# Altium project SHIELD5.PrjPCB
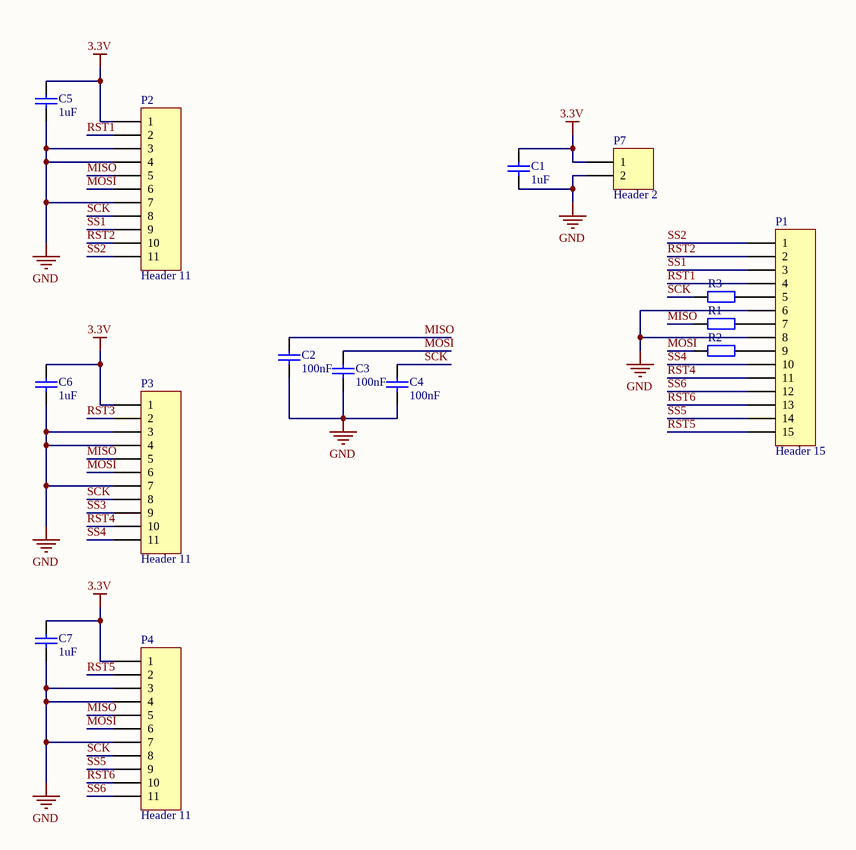
[diagram p0: SHIELD5.SchDoc]
1 sheet, 15 parts. Net scope: global (net labels, ports and power ports of the same name join across sheets).
Board file: PCB5.PcbDoc

## Sheet SHIELD5.SchDoc
size A4

### Parts
C1  value 1uF  [C0805]  (hidden comment: Cap)
C2  value 100nF  [C0805]  (hidden comment: Cap)
C3  value 100nF  [C0805]  (hidden comment: Cap)
C4  value 100nF  [C0805]  (hidden comment: Cap)
C5  value 1uF  [C0805]  (hidden comment: Cap)
C6  value 1uF  [C0805]  (hidden comment: Cap)
C7  value 1uF  [C0805]  (hidden comment: Cap)
P1  Header 15  [HDR1X15]
P2  Header 11  [HDR1X11]
P3  Header 11  [HDR1X11]
P4  Header 11  [HDR1X11]
P7  Header 2  [HDR1X2]
R1  Res2  [6-0805_N]  (value not drawn)
R2  Res2  [6-0805_N]  (value not drawn)
R3  Res2  [6-0805_N]  (value not drawn)

### Nets
3.3V: C1.2 C5.2 C6.2 C7.2 P2.1 P3.1 P4.1 P7.1
GND: C1.1 C2.1 C3.2 C4.2 C5.1 C6.1 C7.1 P1.6 P1.8 P2.3 P2.4 P2.7 P3.3 P3.4 P3.7 P4.3 P4.4 P4.7 P7.2
MISO: C2.2 P2.5 P3.5 P4.5 R1.1
MOSI: C3.1 P2.6 P3.6 P4.6 R2.1
RST1: P1.4 P2.2
RST2: P1.2 P2.10
RST3: P3.2
RST4: P1.11 P3.10
RST5: P1.15 P4.2
RST6: P1.13 P4.10
SCK: C4.1 P2.8 P3.8 P4.8 R3.1
SS1: P1.3 P2.9
SS2: P1.1 P2.11
SS3: P3.9
SS4: P1.10 P3.11
SS5: P1.14 P4.9
SS6: P1.12 P4.11
NetP1_5: P1.5 R3.2
NetP1_7: P1.7 R1.2
NetP1_9: P1.9 R2.2

### Library data of the parts
C1-C7 = Cap: Capacitor; Published: 8-Jun-2000; LatestRevisionDate: 17-Jul-2002; LatestRevisionNote: Re-released for DXP Platform.; PackageReference: RAD-0.3; Publisher: Altium Limited; PackageDescription: Radial Cap, Thru-Hole; 2 Leads; 0.3 in Pin Spacing
P1 = Header 15: Header, 15-Pin; LatestRevisionDate: 17-Jul-2002; LatestRevisionNote: Re-released for DXP Platform.; Publisher: Altium Limited
P2-P4 = Header 11: Header, 11-Pin; LatestRevisionDate: 17-Jul-2002; LatestRevisionNote: Re-released for DXP Platform.; Publisher: Altium Limited
P7 = Header 2: Header, 2-Pin; LatestRevisionDate: 17-Jul-2002; LatestRevisionNote: Re-released for DXP Platform.; Publisher: Altium Limited
R1-R3 = Res2: Resistor; Value: 1K; Published: 8-Jun-2000; LatestRevisionDate: 17-Jul-2002; LatestRevisionNote: Re-released for DXP Platform.; PackageReference: AXIAL-0.4; Publisher: Altium Limited; PackageDescription: Axial Device, Thru-Hole; 2 Leads; 0.4 in Pin Spacing